# Altium project MB1225.PrjPCB (part 3 of 4)

## Sheet USB_OTG_HS.SchDoc: USB OTG HS PHY with micro A-B connector
size A4; Date: 29-OCT-2015; Author: A.B; CompanyName: STMicroelectronics; Organization: MCD/TOOLS/GNB; Address1: 12, Rue Jules HOROWITZ; Address2: 38019 Grenoble; Address3: FRANCE; DocumentNumber: MB1225; Revision: B-01; SheetNumber: 9; SheetTotal: 13; Project: STM32F769I-DISCO
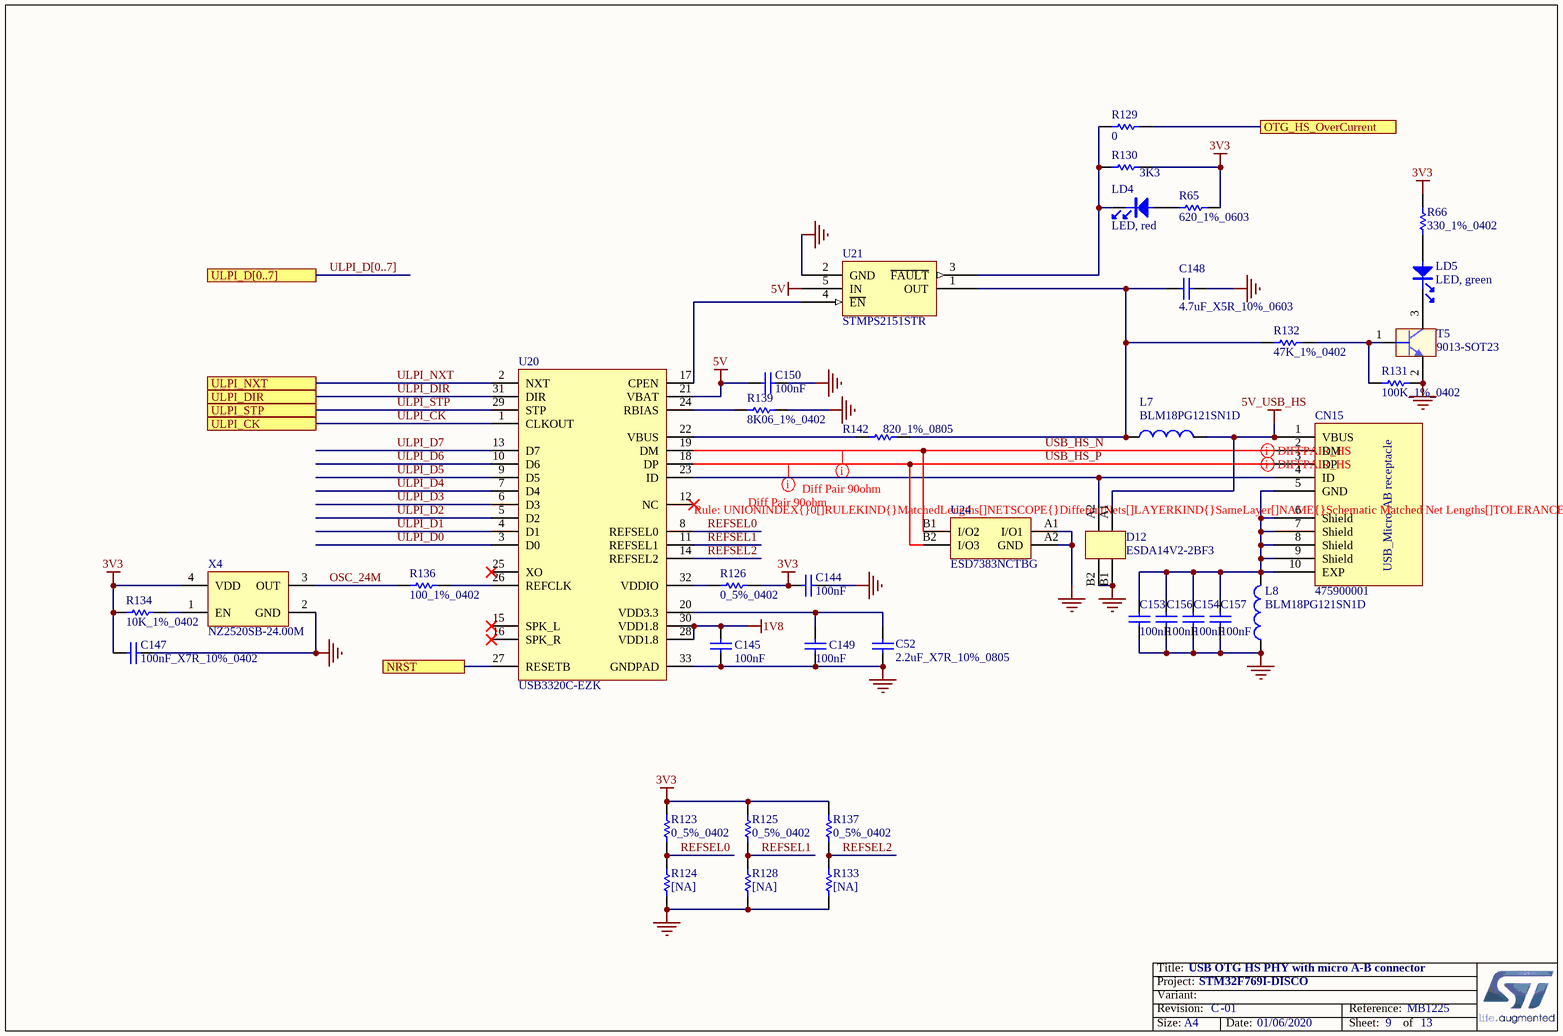
[diagram p8: USB_OTG_HS.SchDoc]

### Parts
C52  2.2uF_X7R_10%_0805  [TAN-A]
C144  100nF  [0402C]
C145  100nF  [0402C]
C147  100nF_X7R_10%_0402  [0402C]
C148  4.7uF_X5R_10%_0603  [0603C]
C149  100nF  [0402C]
C150  100nF  [0402C]
C153  100nF  [0402C]
C154  100nF  [0402C]
C156  100nF  [0402C]
C157  100nF  [0402C]
CN15  475900001  [MOLEX_47590001]
D12  ESDA14V2-2BF3  [BGA4_0R4_0R8X0R8]
L7  BLM18PG121SN1D  [0603L]
L8  BLM18PG121SN1D  [0603L]
LD4  LED, red  [0603D]
LD5  LED, green  [0603D]
R65  620_1%_0603  [0603R]
R66  330_1%_0402  [0402R]
R123  0_5%_0402  [0402R]
R124  [NA]  [0402R]
R125  0_5%_0402  [0402R]
R126  0_5%_0402  [0402R]
R128  [NA]  [0402R]
R129  0  [0402R]
R130  3K3  [0402R]
R131  100K_1%_0402  [0402R]
R132  47K_1%_0402  [0402R]
R133  [NA]  [0402R]
R134  10K_1%_0402  [0402R]
R136  100_1%_0402  [0402R]
R137  0_5%_0402  [0402R]
R139  8K06_1%_0402  [0402R]
R142  820_1%_0805  [0805R]
T5  9013-SOT23  [SOT-23]
U20  USB3320C-EZK  [QFN32_0R5_5X5]
U21  STMPS2151STR  [SOT23-5]
U24  ESD7383NCTBG  [ESD_WLCSP4_CASE-567CB_0P80X0P80_P040]
X4  NZ2520SB-24.00M  [OSC_4SM_2R5X2]

### Ports
NRST, OTG_HS_OverCurrent, ULPI_CK, ULPI_D[0..7], ULPI_DIR, ULPI_NXT, ULPI_STP

### Nets
1V8: C145.2 U20.28(VDD1.8) U20.30(VDD1.8)
3V3: C144.1 C147.1 R65.2 R66.2 R123.2 R125.2 R126.2 R130.1 R134.1 R137.2 X4.4(VDD)
5V: C150.1 U20.21(VBAT) U21.5(IN)
5V_USB_HS: CN15.1(VBUS) D12.A1 L7.2
GND: C52.1 C144.2 C145.1 C147.2 C148.2 C149.1 C150.2 C153.1 C154.1 C156.1 C157.1 D12.B1 D12.B2 L8.1 R124.1 R128.1 R131.2 R133.1 R139.2 T5.2(E) U20.33(GNDPAD) U21.2(GND) U24.A1(I/O1) U24.A2(GND) X4.2(GND)  [project net POE7]
NRST: U20.27(RESETB) ; port NRST
OSC_24M: R136.1 X4.3(OUT)
OTG_HS_OverCurrent: R129.2 ; port OTG_HS_OverCurrent
REFSEL0: R123.1 R124.2 U20.8(REFSEL0)
REFSEL1: R125.1 R128.2 U20.11(REFSEL1)
REFSEL2: R133.2 R137.1 U20.14(REFSEL2)
ULPI_CK: U20.1(CLKOUT) ; port ULPI_CK
ULPI_D0: U20.3(D0)
ULPI_D1: U20.4(D1)
ULPI_D2: U20.5(D2)
ULPI_D3: U20.6(D3)
ULPI_D4: U20.7(D4)
ULPI_D5: U20.9(D5)
ULPI_D6: U20.10(D6)
ULPI_D7: U20.13(D7)
ULPI_DIR: U20.31(DIR) ; port ULPI_DIR
ULPI_NXT: U20.2(NXT) ; port ULPI_NXT
ULPI_STP: U20.29(STP) ; port ULPI_STP
USB_HS_N: CN15.2(DM) U20.19(DM) U24.B1(I/O2)
USB_HS_P: CN15.3(DP) U20.18(DP) U24.B2(I/O3)
NetC52_2: C52.2 C149.2 U20.20(VDD3.3)
NetC148_1: C148.1 L7.1 R132.1 R142.2 U21.1(OUT)
NetC153_2: C153.2 C154.2 C156.2 C157.2 CN15.5(GND) CN15.6(Shield) CN15.7(Shield) CN15.8(Shield) CN15.9(Shield) CN15.10(EXP) L8.2
NetCN15_4: CN15.4(ID) D12.A2 U20.23(ID)
NetLD4_1: LD4.1 R65.1
NetLD4_2: LD4.2 R129.1 R130.2 U21.3(~{FAULT})
NetLD5_1: LD5.1 R66.1
NetLD5_2: LD5.2 T5.3(C)
NetR126_1: R126.1 U20.32(VDDIO)
NetR131_1: R131.1 R132.2 T5.1(B)
NetR134_2: R134.2 X4.1(EN)
NetR136_2: R136.2 U20.26(REFCLK)
NetR139_1: R139.1 U20.24(RBIAS)
NetR142_1: R142.1 U20.22(VBUS)
NetU20_17: U20.17(CPEN) U21.4(~{EN})

Not connected (* = marked no-connect by the designer): U20 12(NC)* 15(SPK_L)* 16(SPK_R)* 25(XO)*

### Buses and harness runs
bus ULPI_D[0..7] = port ULPI_D[0..7]

### Layout directives
differential pair: USB_HS_N, USB_HS_P
rule Matched Net Lengths [Tolerance = 150mil]: USB_HS_N, USB_HS_P

### Notes on the sheet
- Title:
- Project:
- Size:
- Revision:
- Variant:
- A4
- -
- Date:
- Reference:
- Sheet:
- of
- (in symbol 475900001) USB_Micro-AB receptacle

### Library data of the parts
C52 = Cap_2.2uF_X7R_10%_0805: Capacitor,2.2uF,16V, X7R,10%,0805,YAGEO; Manuf_Part_1: CC0805KKX7R7BB225; Revision: July-2002: Re-released for DXP Platform.; Value: 2.2uF; Order: CC0805KKX7R7BB225; Manuf_1: YAGEO; ECCN_US/EU: n/a
C144 C145 C147 C149 C150 C153 C154 C156 C157 = Cap_100nF_X7R_10%_0402: Capacitor,100nF,16V,X7R,10%,0402,YAGEO; Manuf_Part_1: CC0402KRX7R7BB104; Revision: July-2002: Re-released for DXP Platform.; Value: 100nF; Order: CC0402KRX7R7BB104; Manuf_1: YAGEO
  C147: ECCN_US/EU: n/a
C148 = Cap_4.7uF_X5R_10%_0603: Capacitor,4.7uF,16V, X5R,10%,0603,YAGEO; Manuf_Part_1: CC0603KRX5R7BB475; Order: CC0603KRX5R7BB105; Revision: July-2002: Re-released for DXP Platform.; Value: 4.7uF; Manuf_1: YAGEO; ECCN_US/EU: n/a
CN15 = 475900001: USB-MICRO-AB, 47590-0001, SMT, MOLEX; Manuf_Part_1: 47590-0001; Manuf_1: MOLEX; ECCN_US/EU: n/a
D12 = ESDA14V2-2BF3: Quad bidirectional Transil array for ESD protection; Manuf_1: STM; ECCN_US/EU: EAR99/NEC; Provided: ST; Ref St: 9179040; Distrib: ST; Manuf_Part_1: ESDA14V2-2BF3
L7 L8 = BEAD_120R_2A_0603: Bead,120R,2A,0603,BLM18PG121SN1D,MURATA; Manuf_Part_3: FCM1608KF-601T03; Manuf_2: TDK; Manuf_Part_2: MPZ1608S300A; Manuf_3: Tai-tech; Value: 100uH; Description_3: Bead,600R,350mA,0603,FCM1608KF-601T03,Tai-tech; Description_2: Bead,30R,5A,0603,MPZ1608S300A,TDK; Revision: July-2002: Re-released for DXP Platform.; ECCN_US/EU: n/a; Manuf_Part_1: BLM18PG121SN1D; Manuf_1: MURATA
LD4 = LED_red: LED, red, 0603; Manuf_1: everlight; Manuf_Part_1: 19-213-R6C-AP1Q2B/3T; ECCN_US/EU: EAR99/NEC; Order: 19-213-R6C-AP1Q2B/3T
LD5 = LED_green: LED, green, 0603; Manuf_1: everlight; Manuf_Part_1: 19-213SYGC/S530-E2/TR8; ECCN_US/EU: EAR99/NEC; Order: 19-213SYGC/S530-E2/TR8
R65 = Res_620_1%_0603: Resistor,620,0603,1%,VISHAY; Manuf_Part_1: CRCW0603620RFKEA; Manuf_1: VISHAY DRALORIC; Value: 620; Order: 2122341; ECCN_US/EU: n/a; Distrib: FARNELL
R66 = Res_330_1%_0402: Resistor,330,0402,1%,YAGEO; Manuf_Part_1: RC0402FR-07330RL; Value: 330; ECCN_US/EU: n/a; Manuf_1: YAGEO; Distrib: DIGIKEY; Order: RC0402FR-07330RL
R123 R125 R126 R137 = Res_0_5%_0402: Resistor,0,0402,5%,YAGEO; Manuf_Part_1: RC0402JR-070RL; Value: 0; Order: 2363467; ECCN_US/EU: n/a; Manuf_1: YAGEO; Distrib: FARNELL
R124 R128 R133 = Res_NA_0402: Resistor,[NA],0402; Fitted: NO; Value: [NA]; ECCN_US/EU: n/a
R129 = Res_0_5%_0402: Resistor,0,0402,5%,YAGEO; Manuf_Part_1: RC0402JR-070RL; Order: 2363467; Value: 0; ECCN_US/EU: n/a; Manuf_1: YAGEO; Distrib: FARNELL
R130 = Res_3K3_1%_0402: Resistor,3K3,0402,1%,YAGEO; Manuf_Part_1: RC0402FR-073K3L; Value: 3K3; Manuf_1: YAGEO; Order: *; ECCN_US/EU: n/a; Distrib: FARNELL
R131 = Res_100K_1%_0402: Resistor,100K,0402,1%,YAGEO; Manuf_Part_1: RC0402FR-07100KL; Manuf_Part_2: RT0402FRE07100KL; Value: 100K; Manuf_1: YAGEO; ECCN_US/EU: n/a; Manuf_2: YAGEO
R132 = Res_47K_1%_0402: Resistor,47K,0402,1%,YAGEO; Manuf_Part_1: RC0402FR-0747KL; Order: 9239430; Value: 47K; Manuf_1: YAGEO; ECCN_US/EU: n/a; Distrib: FARNELL
R134 = Res_10K_1%_0402: Resistor,10K,0402,1%,YAGEO; Manuf_Part_1: RC0402FR-0710KL; Value: 10K; Manuf_1: YAGEO; Order: RC0402FR-0710KL; ECCN_US/EU: n/a
R136 = Res_100_1%_0402: Resistor,100,0402,1%,YAGEO; Manuf_Part_1: RC0402FR-07100RL; Value: 100; Order: 9239111; Manuf_1: YAGEO; ECCN_US/EU: n/a; Distrib: FARNELL
R139 = Res_8K06_1%_0402: Resistor,8K06,0402,1%,YAGEO; Manuf_Part_1: RC0402FR-078K06L; Value: 8K06; Manuf_1: YAGEO; Order: RC0402FR-078K06L; ECCN_US/EU: n/a; Distrib: DIGIKEY
R142 = Res_820_1%_0805: Resistor,820,0805,1%,YAGEO; Manuf_Part_1: RC0805FR-07820RL; Value: 820; Manuf_1: YAGEO; Order: RC0805FR-07820RL; ECCN_US/EU: n/a
T5 = 9013-SOT23: NPN Bipolar Transistor; Manuf_1: NXP; Manuf_Part_1: BSR14; Order: 1081310; ECCN_US/EU: EAR99/NEC; Revision: July-2002: Re-released for DXP Platform.; Distrib: FARNELL
U20 = USB3320C-EZK: USB3320C,  Hi-Speed USB Host, Device or OTG PHY with ULPI Low Pin Interface; Manuf_1: MICROCHIP; Manuf_Part_1: USB3320C-EZK-TR; ECCN_US/EU: EAR99/NEC; Provided: Sub Co; Distrib: MICROCHIP; Order: USB3320C-EZK-TR
U21 = STMPS2151STR: Enhanced single channel power switches; Manuf_1: STM; Provided: ST; ECCN_US/EU: EAR99/NEC; Ref St: xxxxxx; Order: STMPS2151STR; Manuf_Part_1: STMPS2151STR; Distrib: ST
U24 = MCD-01979: Diode, 3-line low capacitance protection for high speed USB; Manufacturer: ON SEMICONDUCTOR; Provided_By: SUBCO; ECCN_EU: NEC; ECCN_US: EAR99; Internal_Part_Number: MCD-01979; Value: ESD7383NCTBG; Status: Checked; Part_Type: Diode; Manufacturer_Part_Number: ESD7383NCTBG; Alternate_Manufacturer: N/A; Alternate_Manufacturer_Part_Number: N/A; ComponentLink1Description: Datasheet; ComponentLink1URL: http://tunmcdsvn.tun.st.com/Component_Datasheet_Library/Trunk/Diodes/ON_Semi_ESD_ESD7383NCTBG; Order_Code_Digikey: ESD7383NCTBGOSCT-ND; Order_Code_Farnell: 3003821RL; Order_Code_RS: N/A
X4 = OSC_24M_NZ2520SB: Oscillator 24.00Mhz, -+50PPM, 3.3V, Temp -55 to +125°C; Manuf_Part_2: KC2520B24.0000C10E00; Manuf_1: NDK; Manuf_Part_1: NZ2520SB 24MHz END4869A; Manuf_2: AVX Corp/Kyocera Corp; ECCN_US/EU: EAR99/NEC; Ref St: 9157032; Provided: ST; Order: *

## Sheet STM32F7.SchDoc: STM32F769NIH6 Connexion
size A3; Date: 29-OCT-2015; Author: A.B; CompanyName: STMicroelectronics; Organization: MCD/TOOLS/GNB; Address1: 12, Rue Jules HOROWITZ; Address2: 38019 Grenoble; Address3: FRANCE; DocumentNumber: MB1225; Revision: B-01; SheetNumber: 4; SheetTotal: 13; Project: STM32F769I-DISCO
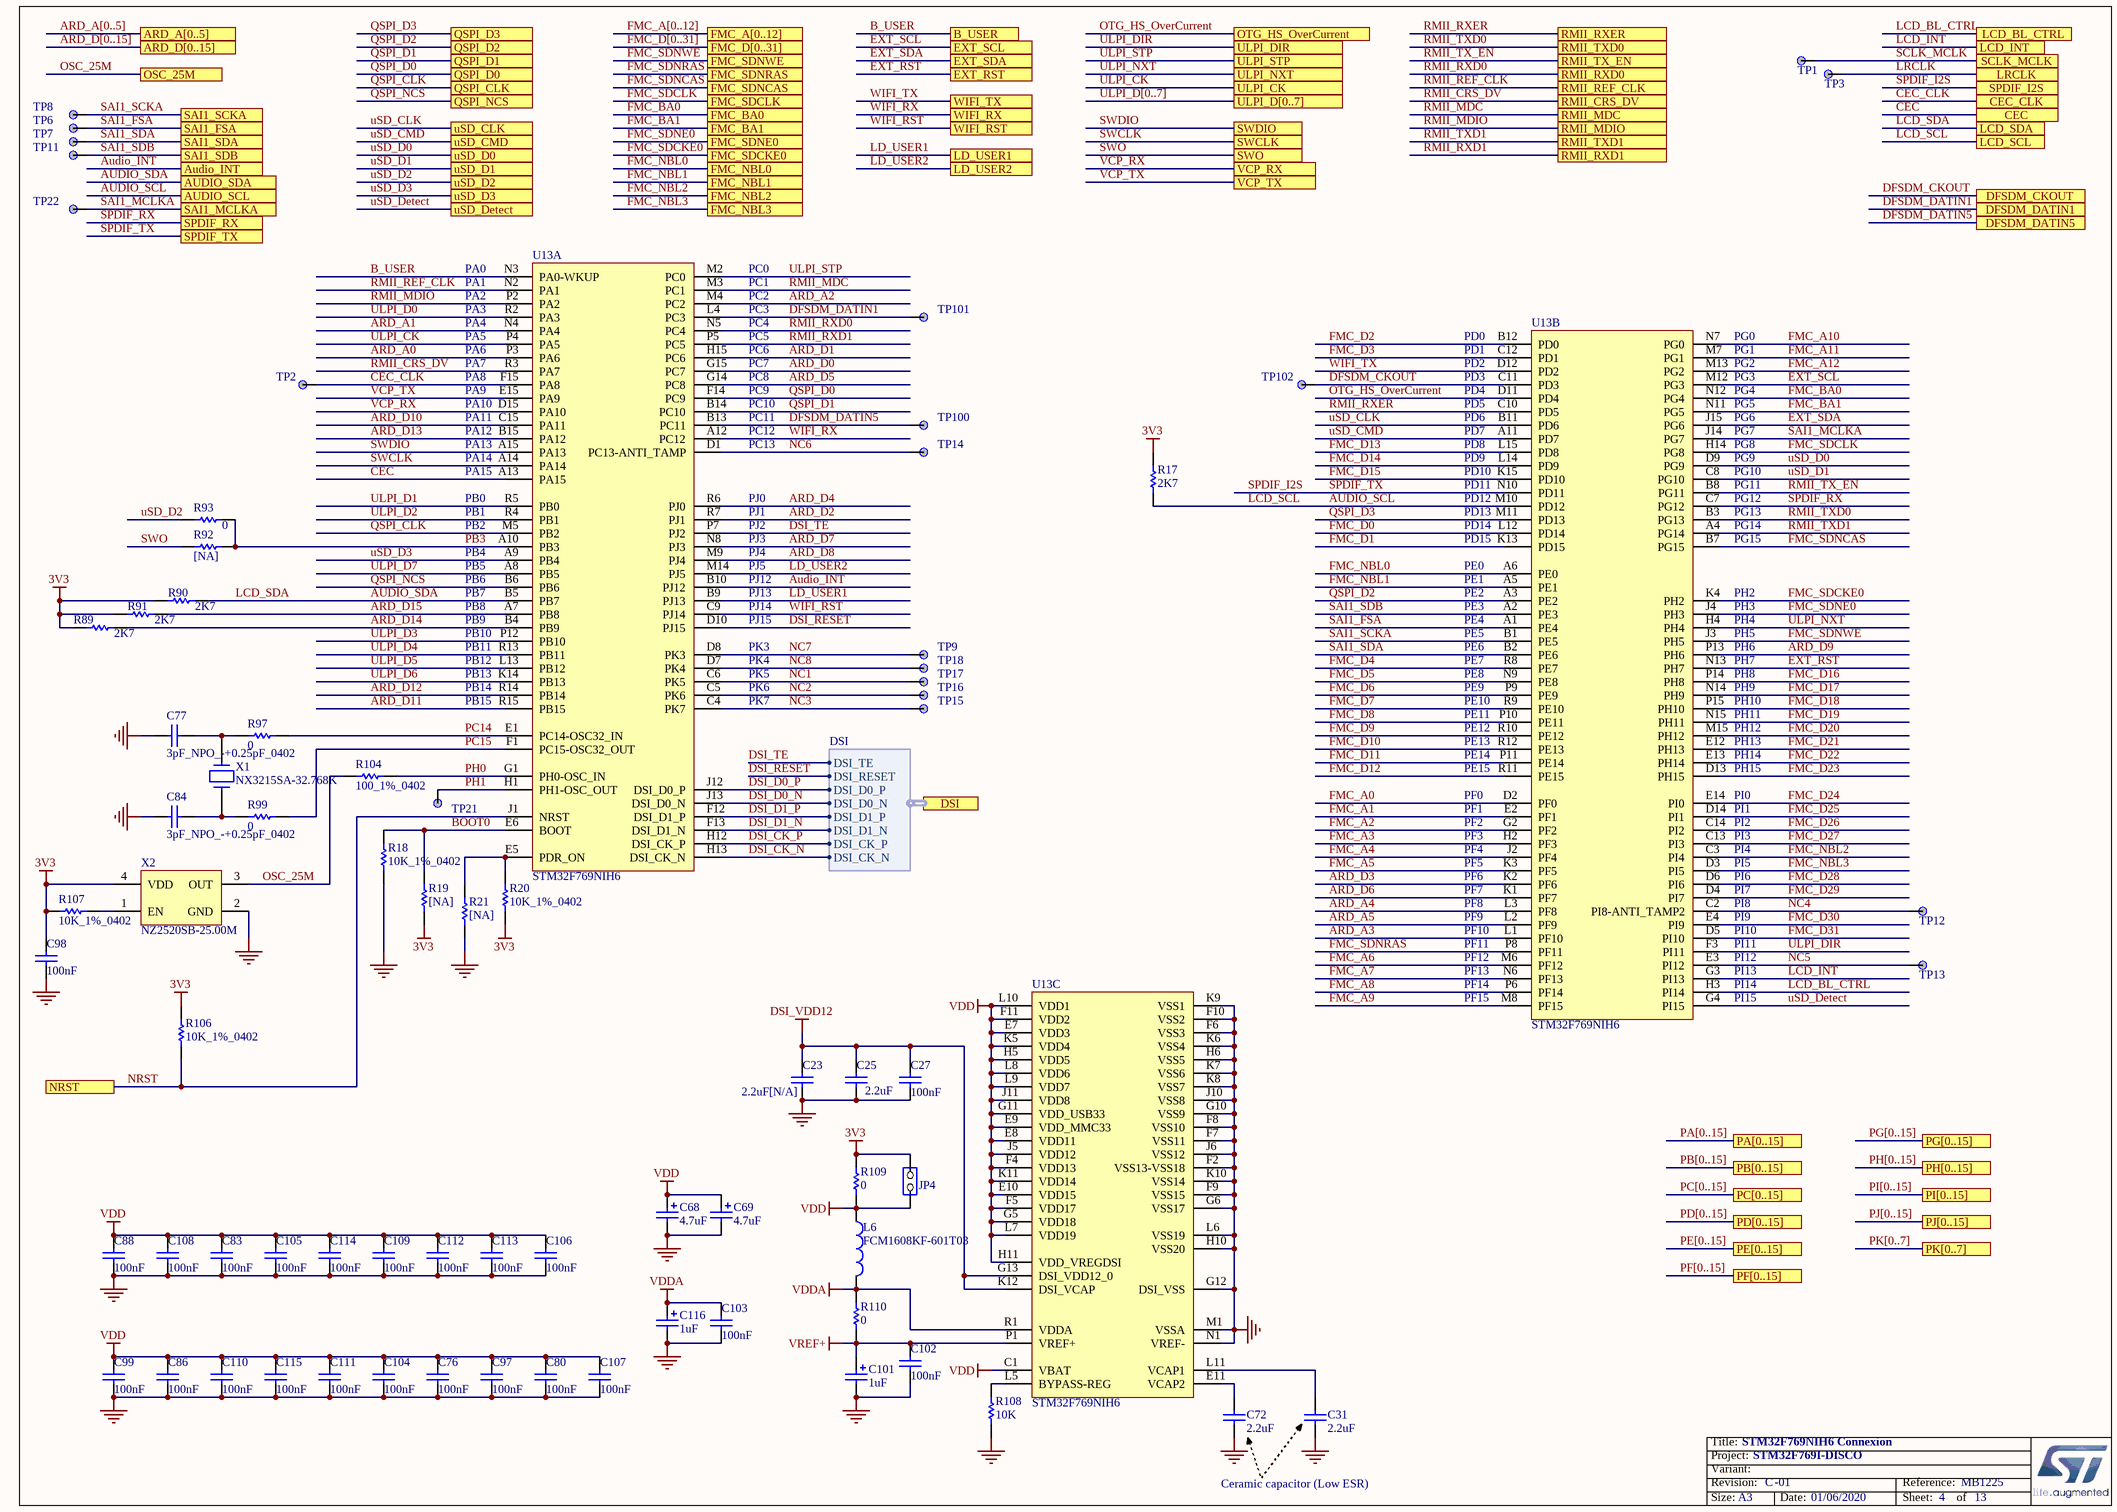
[diagram p9: STM32F7.SchDoc]

### Parts
C23  2.2uF[N/A]  [1206C]
C25  2.2uF  [0603C]
C27  100nF  [0402C]
C31  2.2uF  [1206C]
C68  4.7uF  [TAN-A]
C69  4.7uF  [TAN-A]
C72  2.2uF  [1206C]
C76  100nF  [0402C]
C77  3pF_NPO_-+0.25pF_0402  [0402C]
C80  100nF  [0402C]
C83  100nF  [0402C]
C84  3pF_NPO_-+0.25pF_0402  [0402C]
C86  100nF  [0402C]
C88  100nF  [0402C]
C97  100nF  [0402C]
C98  100nF  [0402C]
C99  100nF  [0402C]
C101  1uF  [TAN-A]
C102  100nF  [0402C]
C103  100nF  [0402C]
C104  100nF  [0402C]
C105  100nF  [0402C]
C106  100nF  [0402C]
C107  100nF  [0402C]
C108  100nF  [0402C]
C109  100nF  [0402C]
C110  100nF  [0402C]
C111  100nF  [0402C]
C112  100nF  [0402C]
C113  100nF  [0402C]
C114  100nF  [0402C]
C115  100nF  [0402C]
C116  1uF  [TAN-A]
JP4  JP2  [SIP2]  (value not drawn)
L6  FCM1608KF-601T03  [0603L]
R17  2K7  [0402R]
R18  10K_1%_0402  [0402R]
R19  [NA]  [0402R]
R20  10K_1%_0402  [0402R]
R21  [NA]  [0402R]
R89  2K7  [0402R]
R90  2K7  [0402R]
R91  2K7  [0402R]
R92  [NA]  [0402R]
R93  0  [0402R]
R97  0  [0402R]
R99  0  [0402R]
R104  100_1%_0402  [0402R]
R106  10K_1%_0402  [0402R]
R107  10K_1%_0402  [0402R]
R108  10K  [0402R]
R109  0  [0603R-GS]
R110  0  [0603R-GS]
TP1  TP  [TP_C40]  (value not drawn)
TP2  TP  [TP_C40]  (value not drawn)
TP3  TP  [TP_C40]  (value not drawn)
TP6  TP  [TP_C40]  (value not drawn)
TP7  TP  [TP_C40]  (value not drawn)
TP8  TP  [TP_C40]  (value not drawn)
TP9  TP  [TP_C40]  (value not drawn)
TP11  TP  [TP_C40]  (value not drawn)
TP12  TP  [TP_C40]  (value not drawn)
TP13  TP  [TP_C40]  (value not drawn)
TP14  TP  [TP_C40]  (value not drawn)
TP15  TP  [TP_C40]  (value not drawn)
TP16  TP  [TP_C40]  (value not drawn)
TP17  TP  [TP_C40]  (value not drawn)
TP18  TP  [TP_C40]  (value not drawn)
TP21  TP  [TP_C40]  (value not drawn)
TP22  TP  [TP_C40]  (value not drawn)
TP100  TP  [TP_C40]  (value not drawn)
TP101  TP  [TP_C40]  (value not drawn)
TP102  TP  [TP_C40]  (value not drawn)
U13  STM32F769NIH6  [BGA216_0R8_13X13]  (parts A,B,C of 3)
X1  NX3215SA-32.768K  [XTAL_2SM_3R2X1R5]
X2  NZ2520SB-25.00M  [OSC_4SM_2R5X2]

### Ports
ARD_A[0..5], ARD_D[0..15], Audio_INT, AUDIO_SCL, AUDIO_SDA, B_USER, CEC, CEC_CLK, DFSDM_CKOUT, DFSDM_DATIN1, DFSDM_DATIN5, DSI (harness DSI), EXT_RST, EXT_SCL, EXT_SDA, FMC_A[0..12], FMC_BA0, FMC_BA1, FMC_D[0..31], FMC_NBL0, FMC_NBL1, FMC_NBL2, FMC_NBL3, FMC_SDCKE0, FMC_SDCLK, FMC_SDNCAS, FMC_SDNE0, FMC_SDNRAS, FMC_SDNWE, LCD_BL_CTRL, LCD_INT, LCD_SCL, LCD_SDA, LD_USER1, LD_USER2, LRCLK, NRST, OSC_25M, OTG_HS_OverCurrent, PA[0..15], PB[0..15], PC[0..15], PD[0..15], PE[0..15], PF[0..15], PG[0..15], PH[0..15], PI[0..15], PJ[0..15], PK[0..7], QSPI_CLK, QSPI_D0, QSPI_D1, QSPI_D2, QSPI_D3, QSPI_NCS, RMII_CRS_DV, RMII_MDC, RMII_MDIO, RMII_REF_CLK, RMII_RXD0, RMII_RXD1, RMII_RXER, RMII_TX_EN, RMII_TXD0, RMII_TXD1, SAI1_FSA, SAI1_MCLKA, SAI1_SCKA, SAI1_SDA, SAI1_SDB, SCLK_MCLK, SPDIF_I2S, SPDIF_RX, SPDIF_TX, SWCLK, SWDIO, SWO, ULPI_CK, ULPI_D[0..7], ULPI_DIR, ULPI_NXT, ULPI_STP, uSD_CLK, uSD_CMD, uSD_D0, uSD_D1, uSD_D2, uSD_D3, uSD_Detect, VCP_RX, VCP_TX, WIFI_RST, WIFI_RX, WIFI_TX

### Harnesses
DSI: DSI_CK_P, DSI_CK_N, DSI_D0_P, DSI_D0_N, DSI_D1_P, DSI_D1_N, DSI_TE, DSI_RESET

### Nets
3V3: C98.2 JP4.2(NO) R17.2 R19.1 R20.1 R89.1 R90.1 R91.1 R106.2 R107.1 R109.2 X2.4(VDD)
DSI_VDD12: C23.2 C25.2 C27.2 U13.G13(DSI_VDD12_0) U13.K12(DSI_VCAP)
GND: C23.1 C25.1 C27.1 C31.1 C68.2 C69.2 C72.1 C76.1 C77.1 C80.1 C83.1 C84.1 C86.1 C88.1 C97.1 C98.1 C99.1 C101.2 C102.1 C103.1 C104.1 C105.1 C106.1 C107.1 C108.1 C109.1 C110.1 C111.1 C112.1 C113.1 C114.1 C115.1 C116.2 R18.1 R21.1 R108.1 U13.F2(VSS13-VSS18) U13.F6(VSS3) U13.F7(VSS11) U13.F8(VSS10) U13.F9(VSS15) U13.F10(VSS2) U13.G6(VSS17) U13.G10(VSS9) U13.G12(DSI_VSS) U13.H6(VSS5) U13.H10(VSS20) U13.J6(VSS12) U13.J10(VSS8) U13.K6(VSS4) U13.K7(VSS6) U13.K8(VSS7) U13.K9(VSS1) U13.K10(VSS14) U13.L6(VSS19) U13.M1(VSSA) U13.N1(VREF-) X2.2(GND)  [project net POE7]
VDD: C68.1 C69.1 C76.2 C80.2 C83.2 C86.2 C88.2 C97.2 C99.2 C104.2 C105.2 C106.2 C107.2 C108.2 C109.2 C110.2 C111.2 C112.2 C113.2 C114.2 C115.2 JP4.1(COMMON) L6.1 R109.1 U13.C1(VBAT) U13.E7(VDD3) U13.E8(VDD11) U13.E9(VDD_MMC33) U13.E10(VDD15) U13.F4(VDD13) U13.F5(VDD17) U13.F11(VDD2) U13.G5(VDD18) U13.G11(VDD_USB33) U13.H5(VDD5) U13.H11(VDD_VREGDSI) U13.J5(VDD12) U13.J11(VDD8) U13.K5(VDD4) U13.K11(VDD14) U13.L7(VDD19) U13.L8(VDD6) U13.L9(VDD7) U13.L10(VDD1)
VDDA: C103.2 C116.1 L6.2 R110.1 U13.R1(VDDA)
VREF+: C101.1 C102.2 R110.2 U13.P1(VREF+)
ARD_A0: U13.P3(PA6)
ARD_A1: U13.N4(PA4)
ARD_A2: U13.M4(PC2)
ARD_A3: U13.L1(PF10)
ARD_A4: U13.L3(PF8)
ARD_A5: U13.L2(PF9)
ARD_D0: U13.G15(PC7)
ARD_D1: U13.H15(PC6)
ARD_D2: U13.R7(PJ1)
ARD_D3: U13.K2(PF6)
ARD_D4: U13.R6(PJ0)
ARD_D5: U13.G14(PC8)
ARD_D6: U13.K1(PF7)
ARD_D7: U13.N8(PJ3)
ARD_D8: U13.M9(PJ4)
ARD_D9: U13.P13(PH6)
ARD_D10: U13.C15(PA11)
ARD_D11: U13.R15(PB15)
ARD_D12: U13.R14(PB14)
ARD_D13: U13.B15(PA12)
ARD_D14: R89.2 U13.B4(PB9)
ARD_D15: R91.2 U13.A7(PB8)
Audio_INT: U13.B10(PJ12) ; port Audio_INT
AUDIO_SCL: R17.1 U13.M10(PD12) ; port AUDIO_SCL, port LCD_SCL  [also labelled LCD_SCL]
AUDIO_SDA: R90.2 U13.B5(PB7) ; port AUDIO_SDA, port LCD_SDA  [also labelled LCD_SDA]
B_USER: U13.N3(PA0-WKUP) ; port B_USER
BOOT0: R18.2 R19.2 U13.E6(BOOT)
CEC: U13.A13(PA15) ; port CEC
CEC_CLK: TP2.1 U13.F15(PA8) ; port CEC_CLK
DFSDM_CKOUT: TP102.1 U13.C11(PD3) ; port DFSDM_CKOUT
DFSDM_DATIN1: TP101.1 U13.L4(PC3) ; port DFSDM_DATIN1
DFSDM_DATIN5: TP100.1 U13.B13(PC11) ; port DFSDM_DATIN5
DSI_CK_N: U13.H13(DSI_CK_N) ; port DSI.DSI_CK_N
DSI_CK_P: U13.H12(DSI_CK_P) ; port DSI.DSI_CK_P
DSI_D0_N: U13.J13(DSI_D0_N) ; port DSI.DSI_D0_N
DSI_D0_P: U13.J12(DSI_D0_P) ; port DSI.DSI_D0_P
DSI_D1_N: U13.F13(DSI_D1_N) ; port DSI.DSI_D1_N
DSI_D1_P: U13.F12(DSI_D1_P) ; port DSI.DSI_D1_P
DSI_RESET: U13.D10(PJ15) ; port DSI.DSI_RESET
DSI_TE: U13.P7(PJ2) ; port DSI.DSI_TE
EXT_RST: U13.N13(PH7) ; port EXT_RST
EXT_SCL: U13.M12(PG3) ; port EXT_SCL
EXT_SDA: U13.J15(PG6) ; port EXT_SDA
FMC_A0: U13.D2(PF0)
FMC_A1: U13.E2(PF1)
FMC_A2: U13.G2(PF2)
FMC_A3: U13.H2(PF3)
FMC_A4: U13.J2(PF4)
FMC_A5: U13.K3(PF5)
FMC_A6: U13.M6(PF12)
FMC_A7: U13.N6(PF13)
FMC_A8: U13.P6(PF14)
FMC_A9: U13.M8(PF15)
FMC_A10: U13.N7(PG0)
FMC_A11: U13.M7(PG1)
FMC_A12: U13.M13(PG2)
FMC_BA0: U13.N12(PG4) ; port FMC_BA0
FMC_BA1: U13.N11(PG5) ; port FMC_BA1
FMC_D0: U13.L12(PD14)
FMC_D1: U13.K13(PD15)
FMC_D2: U13.B12(PD0)
FMC_D3: U13.C12(PD1)
FMC_D4: U13.R8(PE7)
FMC_D5: U13.N9(PE8)
FMC_D6: U13.P9(PE9)
FMC_D7: U13.R9(PE10)
FMC_D8: U13.P10(PE11)
FMC_D9: U13.R10(PE12)
FMC_D10: U13.R12(PE13)
FMC_D11: U13.P11(PE14)
FMC_D12: U13.R11(PE15)
FMC_D13: U13.L15(PD8)
FMC_D14: U13.L14(PD9)
FMC_D15: U13.K15(PD10)
FMC_D16: U13.P14(PH8)
FMC_D17: U13.N14(PH9)
FMC_D18: U13.P15(PH10)
FMC_D19: U13.N15(PH11)
FMC_D20: U13.M15(PH12)
FMC_D21: U13.E12(PH13)
FMC_D22: U13.E13(PH14)
FMC_D23: U13.D13(PH15)
FMC_D24: U13.E14(PI0)
FMC_D25: U13.D14(PI1)
FMC_D26: U13.C14(PI2)
FMC_D27: U13.C13(PI3)
FMC_D28: U13.D6(PI6)
FMC_D29: U13.D4(PI7)
FMC_D30: U13.E4(PI9)
FMC_D31: U13.D5(PI10)
FMC_NBL0: U13.A6(PE0) ; port FMC_NBL0
FMC_NBL1: U13.A5(PE1) ; port FMC_NBL1
FMC_NBL2: U13.C3(PI4) ; port FMC_NBL2
FMC_NBL3: U13.D3(PI5) ; port FMC_NBL3
FMC_SDCKE0: U13.K4(PH2) ; port FMC_SDCKE0
FMC_SDCLK: U13.H14(PG8) ; port FMC_SDCLK
FMC_SDNCAS: U13.B7(PG15) ; port FMC_SDNCAS
FMC_SDNE0: U13.J4(PH3) ; port FMC_SDNE0
FMC_SDNRAS: U13.P8(PF11) ; port FMC_SDNRAS
FMC_SDNWE: U13.J3(PH5) ; port FMC_SDNWE
LCD_BL_CTRL: U13.H3(PI14) ; port LCD_BL_CTRL
LCD_INT: U13.G3(PI13) ; port LCD_INT
LD_USER1: U13.B9(PJ13) ; port LD_USER1
LD_USER2: U13.M14(PJ5) ; port LD_USER2
LRCLK: TP3.1 ; port LRCLK
NC1: TP17.1 U13.C6(PK5)
NC2: TP16.1 U13.C5(PK6)
NC3: TP15.1 U13.C4(PK7)
NC4: TP12.1 U13.C2(PI8-ANTI_TAMP2)
NC5: TP13.1 U13.E3(PI12)
NC6: TP14.1 U13.D1(PC13-ANTI_TAMP)
NC7: TP9.1 U13.D8(PK3)
NC8: TP18.1 U13.D7(PK4)
NRST: R106.1 U13.J1(NRST) ; port NRST
OSC_25M: R104.1 X2.3(OUT) ; port OSC_25M
OTG_HS_OverCurrent: U13.D11(PD4) ; port OTG_HS_OverCurrent
PB3: R92.2 R93.2 U13.A10(PB3)
PC14: R97.2 U13.E1(PC14-OSC32_IN)
PC15: R99.2 U13.F1(PC15-OSC32_OUT)
PH0: R104.2 U13.G1(PH0-OSC_IN)
PH1: TP21.1 U13.H1(PH1-OSC_OUT)
QSPI_CLK: U13.M5(PB2) ; port QSPI_CLK
QSPI_D0: U13.F14(PC9) ; port QSPI_D0
QSPI_D1: U13.B14(PC10) ; port QSPI_D1
QSPI_D2: U13.A3(PE2) ; port QSPI_D2
QSPI_D3: U13.M11(PD13) ; port QSPI_D3
QSPI_NCS: U13.B6(PB6) ; port QSPI_NCS
RMII_CRS_DV: U13.R3(PA7) ; port RMII_CRS_DV
RMII_MDC: U13.M3(PC1) ; port RMII_MDC
RMII_MDIO: U13.P2(PA2) ; port RMII_MDIO
RMII_REF_CLK: U13.N2(PA1) ; port RMII_REF_CLK
RMII_RXD0: U13.N5(PC4) ; port RMII_RXD0
RMII_RXD1: U13.P5(PC5) ; port RMII_RXD1
RMII_RXER: U13.C10(PD5) ; port RMII_RXER
RMII_TX_EN: U13.B8(PG11) ; port RMII_TX_EN
RMII_TXD0: U13.B3(PG13) ; port RMII_TXD0
RMII_TXD1: U13.A4(PG14) ; port RMII_TXD1
SAI1_FSA: TP6.1 U13.A1(PE4) ; port SAI1_FSA
SAI1_MCLKA: TP22.1 U13.J14(PG7) ; port SAI1_MCLKA
SAI1_SCKA: TP8.1 U13.B1(PE5) ; port SAI1_SCKA
SAI1_SDA: TP7.1 U13.B2(PE6) ; port SAI1_SDA
SAI1_SDB: TP11.1 U13.A2(PE3) ; port SAI1_SDB
SCLK_MCLK: TP1.1 ; port SCLK_MCLK
SPDIF_I2S: U13.N10(PD11) ; port SPDIF_TX, port SPDIF_I2S  [also labelled SPDIF_TX]
SPDIF_RX: U13.C7(PG12) ; port SPDIF_RX
SWCLK: U13.A14(PA14) ; port SWCLK
SWDIO: U13.A15(PA13) ; port SWDIO
SWO: R92.1 ; port SWO
ULPI_CK: U13.P4(PA5) ; port ULPI_CK
ULPI_D0: U13.R2(PA3)
ULPI_D1: U13.R5(PB0)
ULPI_D2: U13.R4(PB1)
ULPI_D3: U13.P12(PB10)
ULPI_D4: U13.R13(PB11)
ULPI_D5: U13.L13(PB12)
ULPI_D6: U13.K14(PB13)
ULPI_D7: U13.A8(PB5)
ULPI_DIR: U13.F3(PI11) ; port ULPI_DIR
ULPI_NXT: U13.H4(PH4) ; port ULPI_NXT
ULPI_STP: U13.M2(PC0) ; port ULPI_STP
uSD_CLK: U13.B11(PD6) ; port uSD_CLK
uSD_CMD: U13.A11(PD7) ; port uSD_CMD
uSD_D0: U13.D9(PG9) ; port uSD_D0
uSD_D1: U13.C8(PG10) ; port uSD_D1
uSD_D2: R93.1 ; port uSD_D2
uSD_D3: U13.A9(PB4) ; port uSD_D3
uSD_Detect: U13.G4(PI15) ; port uSD_Detect
VCP_RX: U13.D15(PA10) ; port VCP_RX
VCP_TX: U13.E15(PA9) ; port VCP_TX
WIFI_RST: U13.C9(PJ14) ; port WIFI_RST
WIFI_RX: U13.A12(PC12) ; port WIFI_RX
WIFI_TX: U13.D12(PD2) ; port WIFI_TX
NetC31_2: C31.2 U13.L11(VCAP1)
NetC72_2: C72.2 U13.E11(VCAP2)
NetC77_2: C77.2 R97.1 X1.1
NetC84_2: C84.2 R99.1 X1.2
NetR20_2: R20.2 R21.2 U13.E5(PDR_ON)
NetR107_2: R107.2 X2.1(EN)
NetR108_2: R108.2 U13.L5(BYPASS-REG)

### Buses and harness runs
bus ARD_A[0..5] = port ARD_A[0..5]
bus ARD_D[0..15] = port ARD_D[0..15]
bus FMC_A[0..12] = port FMC_A[0..12]
bus FMC_D[0..31] = port FMC_D[0..31]
bus PA[0..15] = port PA[0..15]
bus PB[0..15] = port PB[0..15]
bus PC[0..15] = port PC[0..15]
bus PD[0..15] = port PD[0..15]
bus PE[0..15] = port PE[0..15]
bus PF[0..15] = port PF[0..15]
bus PG[0..15] = port PG[0..15]
bus PH[0..15] = port PH[0..15]
bus PI[0..15] = port PI[0..15]
bus PJ[0..15] = port PJ[0..15]
bus PK[0..7] = port PK[0..7]
bus ULPI_D[0..7] = port ULPI_D[0..7]

### Notes on the sheet
- (near U13) PA3
- (near U13) PA2
- (near U13) PA1
- (near U13) PA0
- PC0
- PC1
- PC2
- PC3
- (near U13) PA6
- (near U13) PA5
- (near U13) PA4
- (near U13) PA7
- (near U13) PA8
- PC4
- PC5
- PC6
- PC7
- PC8
- (near U13) PD0
- (near U13) PD1
- (near U13) PD2
- (near U13) PD3
- (near U13) PG0
- (near U13) PG1
- (near U13) PG2
- (near U13) PG3
- (near U13) PA9
- (near U13) PA10
- (near U13) PA11
- (near U13) PA12
- (near U13) PA13
- PC9
- PC10
- PC11
- PC12
- PC13
- (near U13) PD4
- (near U13) PD5
- (near U13) PD6
- (near U13) PD7
- (near U13) PD8
- (near U13) PG4
- (near U13) PG5
- (near U13) PG6
- (near U13) PG7
- (near U13) PG8
- (near U13) PA14
- (near U13) PA15
- (near U13) PB1
- (near U13) PB0
- PJ0
- PJ1
- (near U13) PD9
- (near U13) PD10
- (near U13) PD11
- (near U13) PD12
- (near U13) PD13
- (near U13) PG9
- (near U13) PG10
- (near U13) PG11
- (near U13) PG12
- (near U13) PG13
- (near U13) PB6
- (near U13) PB5
- (near U13) PB4
- (near U13) PB2
- PJ2
- PJ3
- PJ4
- PJ5
- PJ12
- (near U13) PD14
- (near U13) PD15
- (near U13) PE0
- (near U13) PE1
- (near U13) PG14
- (near U13) PG15
- (near U13) PB7
- (near U13) PB8
- (near U13) PB9
- (near U13) PB10
- (near U13) PB11
- PJ13
- PJ14
- PJ15
- PK3
- (near U13) PE2
- (near U13) PE3
- (near U13) PE4
- (near U13) PE5
- (near U13) PE6
- (near U13) PH2
- (near U13) PH3
- (near U13) PH4
- (near U13) PH5
- (near U13) PH6
- (near U13) PB12
- (near U13) PB13
- (near U13) PB14
- (near U13) PB15
- PK4
- PK5
- PK6
- PK7
- (near U13) PE7
- (near U13) PE8
- (near U13) PE9
- (near U13) PE10
- (near U13) PE11
- (near U13) PH7
- (near U13) PH8
- (near U13) PH9
- (near U13) PH10
- (near U13) PH11
- (near U13) PE12
- (near U13) PE13
- (near U13) PE14
- (near U13) PE15
- (near U13) PH12
- (near U13) PH13
- (near U13) PH14
- (near U13) PH15
- (near U13) PF0
- (near U13) PF1
- (near U13) PF2
- (near U13) PF3
- (near U13) PF4
- (near U13) PI0
- (near U13) PI1
- (near U13) PI2
- (near U13) PI3
- (near U13) PI4
- (near U13) PF5
- (near U13) PF6
- (near U13) PF7
- (near U13) PF8
- (near U13) PF9
- (near U13) PI5
- (near U13) PI6
- (near U13) PI7
- (near U13) PI8
- (near U13) PI9
- (near U13) PF10
- (near U13) PF11
- (near U13) PF12
- (near U13) PF13
- (near U13) PF14
- (near U13) PI10
- (near U13) PI11
- (near U13) PI12
- (near U13) PI13
- (near U13) PI14
- (near U13) PF15
- (near U13) PI15
- Ceramic capacitor (Low ESR)
- Title:
- Project:
- Size:
- Revision:
- Variant:
- A3
- -
- Date:
- Reference:
- Sheet:
- of

### Library data of the parts
C23 = Cap_2.2uF_X7R_10%_1206: Capacitor,2.2uF,16V, X7R,10%,1206,YAGEO; Manuf_Part_1: CC1206KKX7R7BB225; Manuf_Part_2: C1206C225K4RAC; Manuf_2: KEMET; Fitted: NO; Revision: July-2002: Re-released for DXP Platform.; Value: 2.2uF; Order: CC1206KKX7R7BB225; Manuf_1: YAGEO; ECCN_US/EU: n/a
C25 = Cap_2.2uF_X5R_10%_0603: Capacitor,2.2uF,10V, X5R,10%,0603,YAGEO; Manuf_Part_1: CC0603KRX5R6BB225; Manuf_Part_2: C0603C225K8PACTU; Manuf_2: KEMET; Revision: July-2002: Re-released for DXP Platform.; Value: 2.2uF; Order: *; Manuf_1: YAGEO; ECCN_US/EU: n/a
C27 C76 C80 C83 C86 C88 C97-C99 C102-C115 = Cap_100nF_X7R_10%_0402: as C144 on sheet USB_OTG_HS; Revision: July-2002: Re-released for DXP Platform.; Value: 100nF; Order: CC0402KRX7R7BB104; Manuf_1: YAGEO
  C27: ECCN_US/EU: n/a
C31 C72 = Cap_2.2uF_X7R_10%_1206: Capacitor,2.2uF,16V, X7R,10%,1206,YAGEO; Manuf_Part_1: CC1206KKX7R7BB225; Manuf_Part_2: C1206C225K4RAC; Manuf_2: KEMET; Revision: July-2002: Re-released for DXP Platform.; Value: 2.2uF; Order: CC1206KKX7R7BB225; Manuf_1: YAGEO; ECCN_US/EU: n/a
C68 C69 = Cap_4.7uF_POL_10%_TANA: Polarized Capacitor,4.7uF,16V,10%,typeA,AVX; Manuf_Part_1: TAJA475K016R; Revision: July-2002: Re-released for DXP Platform.; Value: 4.7uF; Manuf_1: AVX; Order: TAJA475K016R; ECCN_US/EU: n/a
C77 C84 = Cap_4.3pF_NPO_-+0.25pF_0402: Capacitor, 3pF, 16V, NPO, -+0.25pF, 0402, KEMET; Manuf_1: AVX; Manuf_Part_1: C0402C439C4GACTU; Order: C0402C439C4GACTU-ND; Revision: July-2002: Re-released for DXP Platform.; Value: 3pF; ECCN_US/EU: n/a; Distrib: DIGIKEY
C101 C116 = Cap_1uF_POL_10%_TANA: Polarized Capacitor,1uF,16V,10%,typeA,AVX; Manuf_Part_1: TAJA105K016R; Revision: July-2002: Re-released for DXP Platform.; Value: 1uF; Manuf_1: AVX; Distrib: *; Order: TAJA105K016R; ECCN_US/EU: n/a
JP4 = JP2: Fitted: NO; ECCN_US/EU: n/a
L6 = BEAD_600R_350MA_0603: Bead,600R,350mA,0603,FCM1608KF-601T03,Tai-tech; Manuf_2: TDK; Manuf_Part_2: MPZ1608S300A; Manuf_Part_3: BLM18PG121SN1D; Manuf_3: MURATA; Value: 100uH; Description_2: Bead,30R,5A,0603,MPZ1608S300A,TDK; Description_3: Bead,120R,2A,0603,BLM18PG121SN1D,MURATA; Revision: July-2002: Re-released for DXP Platform.; Manuf_Part_1: FCM1608KF-601T03; Manuf_1: Tai-tech; ECCN_US/EU: n/a
R17 R89-R91 = Res_2K7_1%_0402: Resistor,2K7,0402,1%,YAGEO; Manuf_Part_1: RC0402FR-072K7L; Value: 2K7; Manuf_1: YAGEO; Order: RC0402FR-072K7L; ECCN_US/EU: n/a; Distrib: FARNELL
R18 R20 R106-R108 = Res_10K_1%_0402: as R134 on sheet USB_OTG_HS; Value: 10K; Manuf_1: YAGEO; Order: RC0402FR-0710KL; ECCN_US/EU: n/a
R19 R21 R92 = Res_NA_0402: Resistor,[NA],0402; Fitted: NO; Value: [NA]; ECCN_US/EU: n/a
R93 R97 R99 = Res_0_5%_0402: as R129 on sheet USB_OTG_HS; Value: 0; ECCN_US/EU: n/a; Manuf_1: YAGEO; Distrib: FARNELL
R104 = Res_100_1%_0402: as R136 on sheet USB_OTG_HS; Manuf_1: YAGEO; ECCN_US/EU: n/a; Distrib: FARNELL
R109 R110 = Res_0_5%_0603: Resistor,0,0603,5%,YAGEO; Manuf_Part_1: RC0603JR-070RL; Order: 2363481; Value: 0; ECCN_US/EU: n/a; Manuf_1: YAGEO; Distrib: FARNELL
TP1-TP3 TP6-TP9 TP11-TP18 TP21 TP22 TP100-TP102 = TP: Test Point; ECCN_US/EU: n/a
U13 = STM32F769NIH6U: STM32F769NIH6 (STM32F7 Big Birdie) TBGA216; Manuf_1: STM; ECCN_US/EU: 3A991A2/NEC; Ref St: xxxxxxxx; Provided: ST; Distrib: ST; Manuf_Part_1: STM32F769NIH6U; Order: STM32F769NIH6U
X1 = XTAL_32K_NX3215SA: Crystal 32.768kHz, 6pF, -+20PPM, R=50K, SMD; Manuf_1: NDK; Manuf_Part_1: NX3215SA 32.768KHz EXS00A-MU00525; ECCN_US/EU: EAR99/NEC; Ref St: 9157034; NDK Ref: X3101802; Provided: ST; Distrib: *; Order: NX3215SA 32.768KHz EXS00A-MU00525
X2 = OSC_25M_NZ2520SB: Oscillator 25.00Mhz, -+50PPM, 3.3V, Temp -55 to +125°C; Manuf_Part_1: NZ2520SB 25MHz END4869B; Manuf_1: NDK; Manuf_Part_2: KC2520B25.0000C10E00; Manuf_2: AVX Corp/Kyocera Corp; ECCN_US/EU: EAR99/NEC; Ref St: 9157031; Provided: ST; Order: *

## Sheet Ethernet.SchDoc: Ethernet PHY with RJ45 connector
size A4; Date: 29-OCT-2015; Author: A.B; CompanyName: STMicroelectronics; Organization: MCD/TOOLS/GNB; Address1: 12, Rue Jules HOROWITZ; Address2: 38019 Grenoble; Address3: FRANCE; DocumentNumber: MB1225; Revision: B-01; SheetNumber: 10; SheetTotal: 13; Project: STM32F769I-DISCO
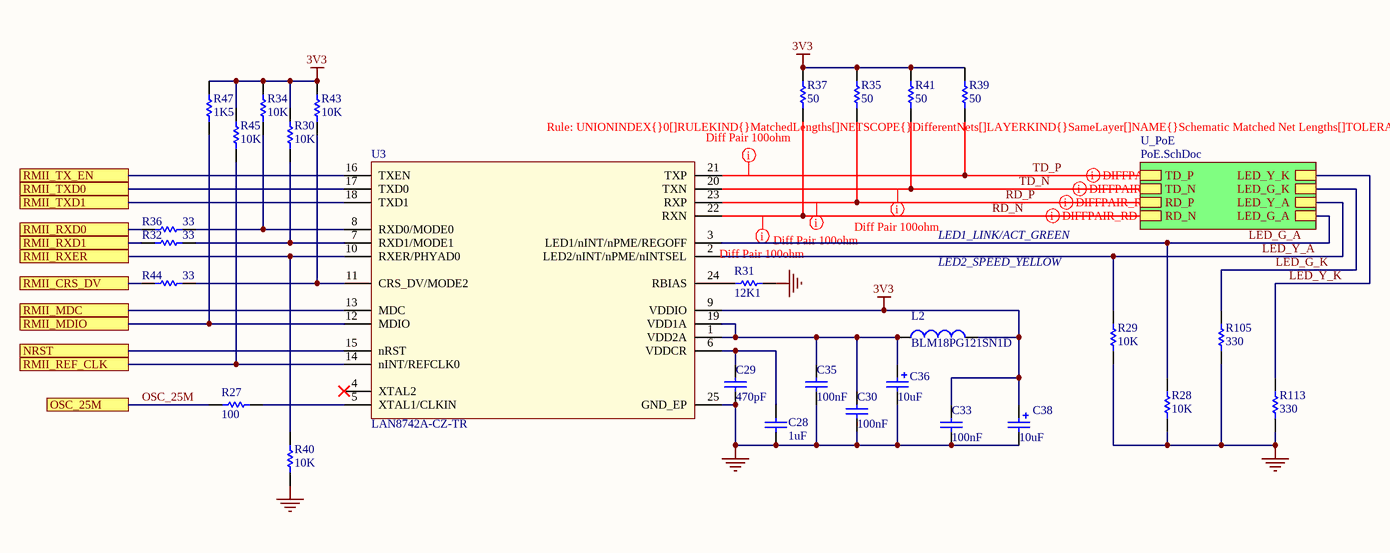
[diagram p10: Ethernet.SchDoc]

### Parts
C28  1uF  [0603C]
C29  470pF  [0402C]
C30  100nF  [0402C]
C33  100nF  [0402C]
C35  100nF  [0402C]
C36  10uF  [TAN-A]
C38  10uF  [TAN-A]
L2  BLM18PG121SN1D  [0603L]
R27  100  [0402R]
R28  10K  [0402R]
R29  10K  [0402R]
R30  10K  [0402R]
R31  12K1  [0603R]
R32  33  [0402R]
R34  10K  [0402R]
R35  50  [0402R]
R36  33  [0402R]
R37  50  [0402R]
R39  50  [0402R]
R40  10K  [0402R]
R41  50  [0402R]
R43  10K  [0402R]
R44  33  [0402R]
R45  10K  [0402R]
R47  1K5  [0402R]
R105  330  [0402R]
R113  330  [0402R]
U3  LAN8742A-CZ-TR  [QFN24_0R5_4X4]

### Sub-sheets
U_PoE = PoE.SchDoc: LED_G_A, LED_G_K, LED_Y_A, LED_Y_K, RD_P, TD_N, TD_P, RD_N

### Ports
NRST, OSC_25M, RMII_CRS_DV, RMII_MDC, RMII_MDIO, RMII_REF_CLK, RMII_RXD0, RMII_RXD1, RMII_RXER, RMII_TX_EN, RMII_TXD0, RMII_TXD1

### Nets
3V3: C33.2 C38.1 L2.2 R30.2 R34.2 R35.1 R37.1 R39.1 R41.1 R43.2 R45.2 R47.2 U3.9(VDDIO)
GND: C28.1 C29.1 C30.1 C33.1 C35.1 C36.2 C38.2 R28.1 R29.1 R31.2 R40.1 R105.1 R113.1 U3.25(GND_EP)  [project net POE7]
LED_G_A: R28.2 U3.3(LED1/nINT/nPME/REGOFF) ; sheet U_PoE/LED_G_A
LED_G_K: R105.2 ; sheet U_PoE/LED_G_K
LED_Y_A: R29.2 U3.2(LED2/nINT/nPME/nINTSEL) ; sheet U_PoE/LED_Y_A
LED_Y_K: R113.2 ; sheet U_PoE/LED_Y_K
NRST: U3.15(nRST) ; port NRST
OSC_25M: R27.1 ; port OSC_25M
RD_N: R37.2 U3.22(RXN) ; sheet U_PoE/RD_N
RD_P: R35.2 U3.23(RXP) ; sheet U_PoE/RD_P
RMII_CRS_DV: R44.2 ; port RMII_CRS_DV
RMII_MDC: U3.13(MDC) ; port RMII_MDC
RMII_MDIO: R47.1 U3.12(MDIO) ; port RMII_MDIO
RMII_REF_CLK: R45.1 U3.14(nINT/REFCLK0) ; port RMII_REF_CLK
RMII_RXD0: R36.2 ; port RMII_RXD0
RMII_RXD1: R32.2 ; port RMII_RXD1
RMII_RXER: R40.2 U3.10(RXER/PHYAD0) ; port RMII_RXER
RMII_TX_EN: U3.16(TXEN) ; port RMII_TX_EN
RMII_TXD0: U3.17(TXD0) ; port RMII_TXD0
RMII_TXD1: U3.18(TXD1) ; port RMII_TXD1
TD_N: R41.2 U3.20(TXN) ; sheet U_PoE/TD_N
TD_P: R39.2 U3.21(TXP) ; sheet U_PoE/TD_P
NetC28_2: C28.2 C29.2 U3.6(VDDCR)
NetC30_2: C30.2 C35.2 C36.1 L2.1 U3.1(VDD2A) U3.19(VDD1A)
NetR27_2: R27.2 U3.5(XTAL1/CLKIN)
NetR30_1: R30.1 R32.1 U3.7(RXD1/MODE1)
NetR31_1: R31.1 U3.24(RBIAS)
NetR34_1: R34.1 R36.1 U3.8(RXD0/MODE0)
NetR43_1: R43.1 R44.1 U3.11(CRS_DV/MODE2)

Not connected (* = marked no-connect by the designer): U3 4(XTAL2)*

### Layout directives
differential pair: RD_N, RD_P, TD_N, TD_P
rule Matched Net Lengths [Tolerance = 100mil]: RD_N, RD_P, TD_N, TD_P

### Notes on the sheet
- LED2_SPEED_YELLOW
- LED1_LINK/ACT_GREEN
- Title:
- Project:
- Size:
- Revision:
- Variant:
- A4
- -
- Date:
- Reference:
- Sheet:
- of

### Library data of the parts
C28 = Cap_1uF_X5R_10%_0603: Capacitor,1uF,16V,X5R,10%,0603,YAGEO; Manuf_Part_1: CC0603KRX5R7BB105; Revision: July-2002: Re-released for DXP Platform.; Value: 1uF; Order: CC0603KRX5R7BB105; Manuf_1: YAGEO; ECCN_US/EU: n/a
C29 = Cap_470pF_X7R_10%_0402: Capacitor,470pF,16V,X7R,10%,0402,YAGEO; Manuf_Part_1: 0402YC471KAT4A; Revision: July-2002: Re-released for DXP Platform.; Value: 470pF; Order: 0402YC471KAT4A; Manuf_1: YAGEO; ECCN_US/EU: n/a
C30 C33 C35 = Cap_100nF_X7R_10%_0402: as C144 on sheet USB_OTG_HS; Revision: July-2002: Re-released for DXP Platform.; Value: 100nF; Order: CC0402KRX7R7BB104; Manuf_1: YAGEO
C36 C38 = Cap_10uF_POL_10%_TANA: Polarized Capacitor,10uF,10V,10%,typeA,VISHAY; Manuf_Part_1: 293D106X9010A2TE3; Revision: July-2002: Re-released for DXP Platform.; Value: 10uF; Manuf_1: VISHAY; Order: *; ECCN_US/EU: n/a
L2 = BEAD_120R_2A_0603: as L7 on sheet USB_OTG_HS; Revision: July-2002: Re-released for DXP Platform.; ECCN_US/EU: n/a; Manuf_Part_1: BLM18PG121SN1D; Manuf_1: MURATA
R27 = Res_100_1%_0402: Resistor,100,0402,1%,YAGEO; Manuf_Part_1: RC0402FR-07100RL; Order: 9239111; Value: 100; Manuf_1: YAGEO; ECCN_US/EU: n/a; Distrib: FARNELL
R28-R30 R34 R40 R43 R45 = Res_10K_1%_0402: as R134 on sheet USB_OTG_HS; Value: 10K; Manuf_1: YAGEO; Order: RC0402FR-0710KL; ECCN_US/EU: n/a
R31 = Res_12K1_1%_0603: Resistor,12K1,0603,1%,VISHAY; Manuf_Part_1: MCT 0603-50 1% P5 12K1; Order: 2325243; Value: 12K1; ECCN_US/EU: n/a; Manuf_1: VISHAY; Distrib: FARNELL
R32 R36 R44 = Res_33_1%_0402: Resistor,33,0402,1%,YAGEO; Manuf_Part_1: RC0402FR-0733RL; Value: 33; Manuf_1: YAGEO; Order: *; ECCN_US/EU: n/a; Distrib: FARNELL
R35 R37 R39 R41 = Res_50_1%_0402: Resistor,50,0402,1%,YAGEO; Manuf_Part_1: RC0402FR-0750RL; Value: 50; Manuf_1: YAGEO; Order: *; ECCN_US/EU: n/a; Distrib: FARNELL
R47 = Res_1K5_1%_0402: Resistor,1K5,0402,1%,YAGEO; Manuf_Part_1: RC0402FR-071K5L; Value: 1K5; Manuf_1: YAGEO; Order: RC0402FR-071K5L; ECCN_US/EU: n/a; Distrib: FARNELL
R105 R113 = Res_330_1%_0402: Resistor,330,0402,1%,YAGEO; Manuf_Part_1: RC0402FR-07330RL; Value: 330; ECCN_US/EU: n/a; Manuf_1: YAGEO; Distrib: DIGIKEY; Order: RC0402FR-07330RL
U3 = LAN8742A-CZ-TR: LAN8742A-CZ-TR - Small Footprint RMII 10/100 Ethernet, Transceiver with HP Auto-MDIX and flexPWR Technology SQFN-24; Manuf_1: MICROCHIP; ECCN_US/EU: EAR99/NEC; Provided: Sub Co; Order: LAN8742A-CZ-TR; Manuf_Part_1: LAN8742A-CZ-TR; Distrib: MICROCHIP

## Sheet PoE.SchDoc: Power Over Ethernet 3W
size A4; Date: 29-OCT-2015; Author: A.B; CompanyName: STMicroelectronics; Organization: MCD/TOOLS/GNB; Address1: 12, Rue Jules HOROWITZ; Address2: 38019 Grenoble; Address3: FRANCE; DocumentNumber: MB1225; Revision: B-01; SheetNumber: 11; SheetTotal: 13; Project: STM32F769I-DISCO
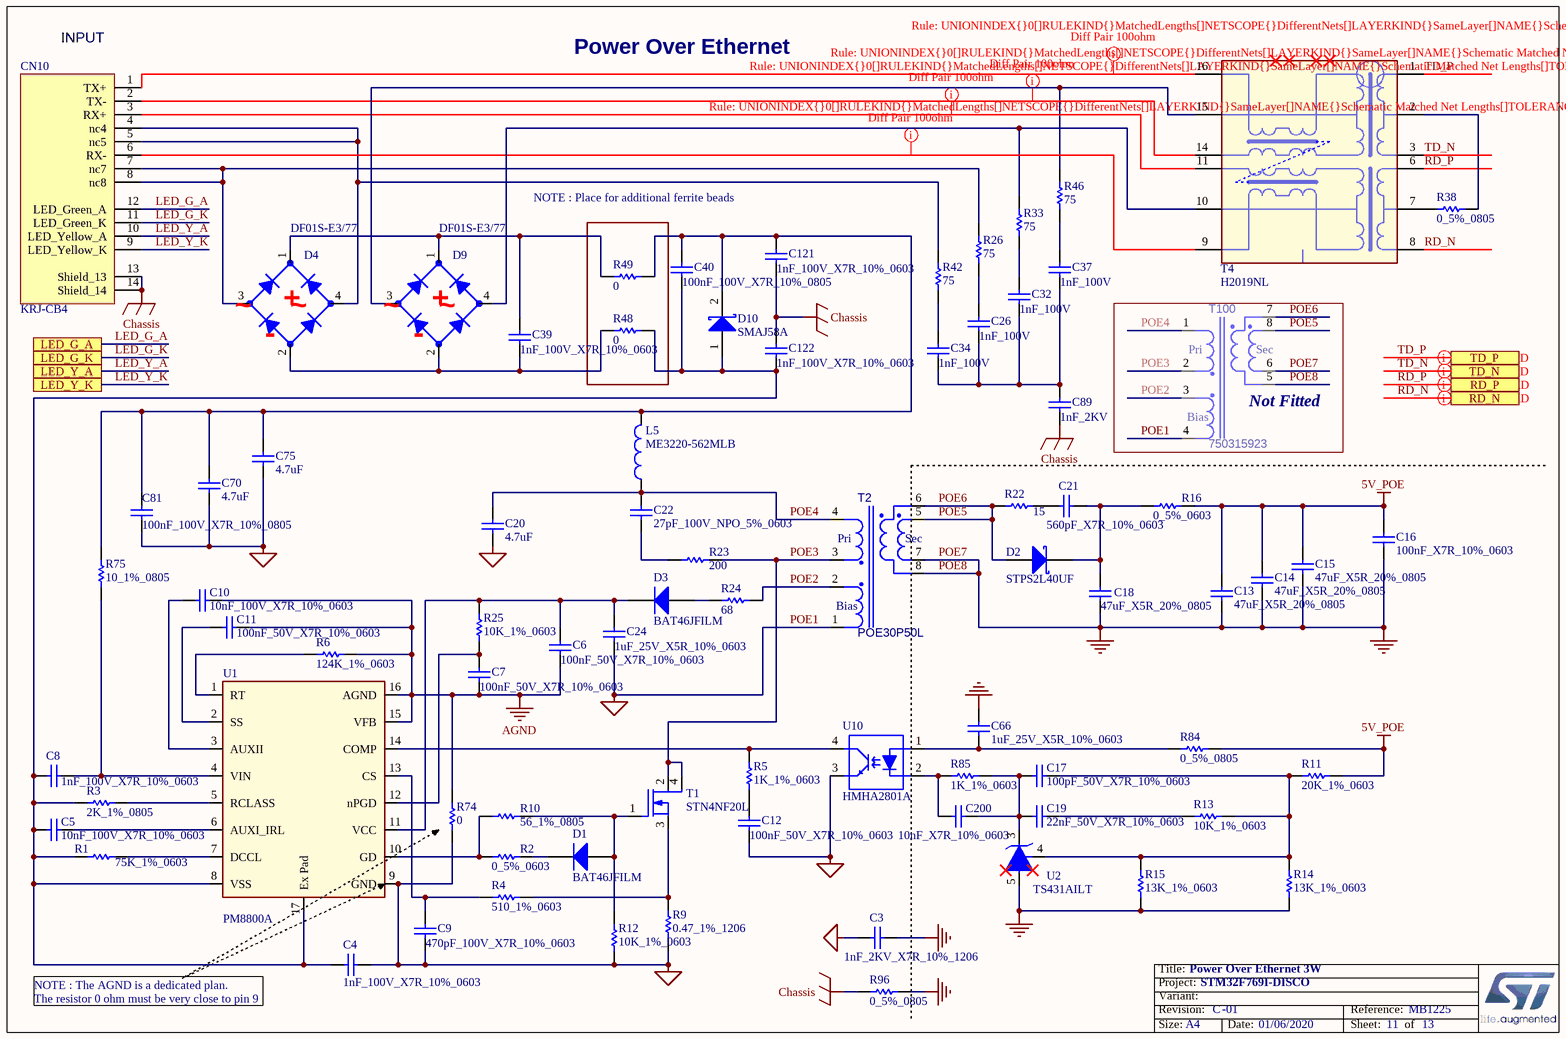
[diagram p11: PoE.SchDoc]

### Parts
C3  1nF_2KV_X7R_10%_1206  [1206C]
C4  1nF_100V_X7R_10%_0603  [0603C]
C5  10nF_100V_X7R_10%_0603  [0603C]
C6  100nF_50V_X7R_10%_0603  [0603C]
C7  100nF_50V_X7R_10%_0603  [0603C]
C8  1nF_100V_X7R_10%_0603  [0603C]
C9  470pF_100V_X7R_10%_0603  [0603C]
C10  10nF_100V_X7R_10%_0603  [0603C]
C11  100nF_50V_X7R_10%_0603  [0603C]
C12  100nF_50V_X7R_10%_0603  [0603C]
C13  47uF_X5R_20%_0805  [0805C]
C14  47uF_X5R_20%_0805  [0805C]
C15  47uF_X5R_20%_0805  [0805C]
C16  100nF_X7R_10%_0603  [0603C]
C17  100pF_50V_X7R_10%_0603  [0603C]
C18  47uF_X5R_20%_0805  [0805C]
C19  22nF_50V_X7R_10%_0603  [0603C]
C20  value 4.7uF  [C1210_H2P5]  (hidden comment: Capacitor)
C21  560pF_X7R_10%_0603  [0603C]
C22  27pF_100V_NPO_5%_0603  [0603C]
C24  1uF_25V_X5R_10%_0603  [0603C]
C26  1nF_100V  [0603C]
C32  1nF_100V  [0603C]
C34  1nF_100V  [0603C]
C37  1nF_100V  [0603C]
C39  1nF_100V_X7R_10%_0603  [0603C]
C40  100nF_100V_X7R_10%_0805  [0805C]
C66  1uF_25V_X5R_10%_0603  [0603C]
C70  value 4.7uF  [C1210_H2P5]  (hidden comment: Capacitor)
C75  value 4.7uF  [C1210_H2P5]  (hidden comment: Capacitor)
C81  100nF_100V_X7R_10%_0805  [0805C]
C89  1nF_2KV  [1206C]
C121  1nF_100V_X7R_10%_0603  [0603C]
C122  1nF_100V_X7R_10%_0603  [0603C]
C200  10nF_X7R_10%_0603  [0603C]
CN10  KRJ-CB4  [RJ45_LED_KRJ-CB4R2GYZNL_EM]
D1  BAT46JFILM  [SOD-323]
D2  STPS2L40UF  [SMB]
D3  BAT46JFILM  [SOD-323]
D4  value DF01S-E3/77  [BRF_VISHAY_DFS_DF01S]
D9  value DF01S-E3/77  [BRF_VISHAY_DFS_DF01S]
D10  SMAJ58A  [SMA]
L5  ME3220-562MLB  [LSM2_3R2X2R8_H2]
R1  75K_1%_0603  [0603R]
R2  0_5%_0603  [0603R-GS]
R3  2K_1%_0805  [0805R]
R4  510_1%_0603  [0603R]
R5  1K_1%_0603  [0603R]
R6  124K_1%_0603  [0603R]
R9  0.47_1%_1206  [1206R]
R10  56_1%_0805  [0805R]
R11  20K_1%_0603  [0603R]
R12  10K_1%_0603  [0603R]
R13  10K_1%_0603  [0603R]
R14  13K_1%_0603  [0603R]
R15  13K_1%_0603  [0603R]
R16  0_5%_0603  [0603R-GS]
R22  15  [0805R]
R23  200  [1206R]
R24  68  [0805R]
R25  10K_1%_0603  [0603R]
R26  75  [0805R]
R33  75  [0805R]
R38  0_5%_0805  [0805R]
R42  75  [0805R]
R46  75  [0805R]
R48  0  [0805R]
R49  0  [0805R]
R74  0  [0603R-GS]
R75  10_1%_0805  [0805R]
R84  0_5%_0805  [0805R]
R85  1K_1%_0603  [0603R]
R96  0_5%_0805  [0805R]
T1  STN4NF20L  [SOT-223]
T2  POE30P50L  [TF_10R9X13R2-12R2X14R4_CPT]
T4  H2019NL  [TF_16SM_12R7X9R65]
T100  750315923  [TF_8SM_12R04X12R85]
U1  PM8800A  [TSSOP16_0R65_5x6R4_TP]
U2  TS431AILT  [SOT23-5]
U10  HMHA2801A  [PC_4SM_1R27_2R5X6R8]

### Blocks framed on the sheet
Not Fitted: T100

### Ports
LED_G_A, LED_G_K, LED_Y_A, LED_Y_K, RD_N, RD_P, TD_N, TD_P

### Nets
5V_POE: C13.2 C14.2 C15.2 C16.2 R11.2 R16.2 R84.2
AGND: C6.1 C7.1 C10.2 C11.2 R6.2 R74.2 U1.15(VFB) U1.16(AGND)
Chassis: C89.1 C121.1 C122.2 CN10.13(Shield_13) CN10.14(Shield_14) R96.1
POE1: C3.1 C4.2 C9.1 C12.1 C20.1 C24.1 C70.1 C75.1 C81.1 R9.1 R12.1 R74.1 T2.1 T100.4 U1.9(GND) U10.3(Emitter)  [also labelled GND_POWER_IN]
POE7: C3.2 C13.1 C14.1 C15.1 C16.1 C18.1 C66.2 R14.1 R15.1 R96.2 T2.7 T2.8 T100.5 T100.6 U2.5(A)  [also labelled GND, POE8]
LED_G_A: CN10.12(LED_Green_A) ; port LED_G_A
LED_G_K: CN10.11(LED_Green_K) ; port LED_G_K
LED_Y_A: CN10.10(LED_Yellow_A) ; port LED_Y_A
LED_Y_K: CN10.9(LED_Yellow_K) ; port LED_Y_K
POE2: R24.2 T2.2 T100.3
POE3: R23.2 T1.2(D) T1.4(D) T2.3 T100.2
POE4: C20.2 C22.2 L5.1 T2.4 T100.1
POE5: D2.1(A) R22.1 T2.5 T2.6 T100.7 T100.8  [also labelled POE6]
RD_N: T4.8(rd-) ; port RD_N
RD_P: T4.6(rd+) ; port RD_P
TD_N: T4.3(td-) ; port TD_N
TD_P: T4.1(td+) ; port TD_P
NetC4_1: C4.1 C5.1 C8.1 C40.1 C122.1 D10.1(A) R1.1 R3.1 R48.2 U1.8(VSS) U1.17(Ex_Pad)
NetC5_2: C5.2 U1.6(AUXI_IRL)
NetC6_2: C6.2 C24.2 D3.2(K) R25.2 U1.11(VCC)
NetC7_2: C7.2 R25.1 U1.12(nPGD)
NetC8_2: C8.2 R75.1 U1.4(VIN)
NetC9_2: C9.2 R4.1 U1.13(CS)
NetC10_1: C10.1 U1.3(AUXII)
NetC11_1: C11.1 U1.2(SS)
NetC12_2: C12.2 R5.1
NetC17_1: C17.1 C19.1 C200.2 R85.2 U2.3(K)
NetC17_2: C17.2 R11.1 R13.2 R14.2 R15.2 U2.4(REF)
NetC18_2: C18.2 C21.2 D2.2(K) R16.1
NetC19_2: C19.2 R13.1
NetC21_1: C21.1 R22.2
NetC22_1: C22.1 R23.1
NetC26_1: C26.1 C32.1 C34.1 C37.1 C89.2
NetC26_2: C26.2 R26.1
NetC32_2: C32.2 R33.1
NetC34_2: C34.2 R42.1
NetC37_2: C37.2 R46.1
NetC39_1: C39.1 D4.2(DC_OUT_MINUS) D9.2(DC_OUT_MINUS) R48.1
NetC39_2: C39.2 D4.1(DC_OUT_PLUS) D9.1(DC_OUT_PLUS) R49.1
NetC40_2: C40.2 C70.2 C75.2 C81.2 C121.2 D10.2(K) L5.2 R49.2 R75.2
NetC66_1: C66.1 R84.1 U10.1(Anode)
NetC200_1: C200.1 R85.1 U10.2(B)
NetCN10_1: CN10.1(TX+) T4.16(tx1+)
NetCN10_2: CN10.2(TX-) T4.14(tx1-)
NetCN10_3: CN10.3(RX+) T4.11(rx1+)
NetCN10_4: CN10.4(nc4) CN10.5(nc5) D4.4(AC_IN_1) R42.2
NetCN10_6: CN10.6(RX-) T4.9(rx-)
NetCN10_7: CN10.7(nc7) CN10.8(nc8) D4.3(AC_IN_2) R26.2
NetD1_1: D1.1(A) R10.2 R12.2 T1.1(G)
NetD1_2: D1.2(K) R2.2
NetD3_1: D3.1(A) R24.1
NetD9_3: D9.3(AC_IN_2) R46.2 T4.15(txct)
NetD9_4: D9.4(AC_IN_1) R33.2 T4.10(rxct)
NetR1_2: R1.2 U1.7(DCCL)
NetR2_1: R2.1 R10.1 U1.10(GD)
NetR3_2: R3.2 U1.5(RCLASS)
NetR4_2: R4.2 R9.2 T1.3(S)
NetR5_2: R5.2 U1.14(COMP) U10.4(Collector)
NetR6_1: R6.1 U1.1(RT)
NetR38_1: R38.1 T4.7(rct)
NetR38_2: R38.2 T4.2(tct)

Not connected (* = marked no-connect by the designer): T4 4(nc_4)* 5(nc_5)* 12(nc_12)* 13(nc_13)*; U2 1(nc_1)* 2(nc_2)*

### Layout directives
differential pair: RD_N, RD_P, TD_N, TD_P
rule Matched Net Lengths [Tolerance = 100mil]: NetCN10_1, NetCN10_2, NetCN10_3, NetCN10_6

### Notes on the sheet
- (near CN10) INPUT
- Power Over Ethernet
- NOTE : Place for additional ferrite beads
- NOTE : The AGND is a dedicated plan.
  The resistor 0 ohm must be very close to pin 9
- Title:
- Project:
- Size:
- Revision:
- Variant:
- A4
- -
- Date:
- Reference:
- Sheet:
- of
- (in symbol MCD-02211) ~; +; -
- (in symbol POE30P_C) Pri; Sec; Bias
- (in symbol POE30P_W) Pri; Sec; Bias

### Library data of the parts
C3 C89 = Cap_1nF_2KV_X7R_10%_1206: Capacitor,1nF,2KV,X7R,10%,1206,YAGEO; Order: CC1206KKX7RDBB102; Revision: July-2002: Re-released for DXP Platform.; Value: 1nF; Manuf_1: YAGEO; Manuf_Part_1: CC1206KKX7RDBB102; ECCN_US/EU: n/a
C4 C8 C26 C32 C34 C37 C39 C121 C122 = Cap_1nF_100V_X7R_10%_0603: Capacitor,1nF,100V,X7R,10%,0603,YAGEO; Order: CC0603KRX7R0BB102; Revision: July-2002: Re-released for DXP Platform.; Value: 1nF; Manuf_1: YAGEO; Manuf_Part_1: CC0603KRX7R0BB102; ECCN_US/EU: n/a
C5 C10 = Cap_10nF_100V_X7R_10%_0603: Capacitor,10nF,100V,X7R,10%,0603,YAGEO; Manuf_Part_1: CC0603KRX7R0BB103; Revision: July-2002: Re-released for DXP Platform.; Value: 10nF; Order: CC0603KRX7R0BB103; Manuf_1: YAGEO; ECCN_US/EU: n/a
C6 C7 C11 C12 = Cap_100nF_50V_X7R_10%_0603: Capacitor,100nF,50V,X7R,10%,0603,YAGEO; Manuf_Part_1: CC0603KRX7R9BB104; Revision: July-2002: Re-released for DXP Platform.; Value: 100nF; Order: CC0603KRX7R9BB104; Manuf_1: YAGEO; ECCN_US/EU: n/a
C9 = Cap_470pF_100V_X7R_10%_0603: Capacitor,470pF,100V,X7R,10%,0603,AVX; Manuf_Part_1: 06031C471KAT2A; Revision: July-2002: Re-released for DXP Platform.; Value: 470pF; Order: 06031C471KAT2A; Manuf_1: AVX; ECCN_US/EU: n/a
C13-C15 C18 = Cap_47uF_X5R_20%_0805: Capacitor,47uF,10V,X5R,20%,0805,MURATA; Manuf_Part_1: GRM21BR61A476ME15K; Order: GRM21BR61A476ME15K-ND; Revision: July-2002: Re-released for DXP Platform.; Value: 47uF; Manuf_1: MURATA; ECCN_US/EU: n/a
C16 = Cap_100nF_X7R_10%_0603: Capacitor,100nF,16V,X7R,10%,0603,YAGEO; Manuf_Part_1: CC0603KRX7R9BB104; Revision: July-2002: Re-released for DXP Platform.; Value: 100nF; Order: CC0603KRX7R9BB104; Manuf_1: YAGEO; ECCN_US/EU: n/a
C17 = Cap_100pF_50V_X7R_10%_0603: Capacitor,100pF,50V,X7R,10%,0603,AVX; Manuf_Part_1: 06035C101JAT4A; Revision: July-2002: Re-released for DXP Platform.; Value: 100pF; Order: 06035C101JAT4A; Manuf_1: AVX; ECCN_US/EU: n/a
C19 = Cap_22nF_50V_X7R_10%_0603: Capacitor,22nF,50V,X7R,10%,0603,YAGEO; Manuf_Part_1: CC0603KRX7R9BB223; Revision: July-2002: Re-released for DXP Platform.; Value: 22nF; Order: CC0603KRX7R9BB223; Manuf_1: YAGEO; ECCN_US/EU: n/a
C20 C70 C75 = MCD-02212: Capacitor, MLCC, 4.7uF, 100V, X7S, +/-10%, 1210 , T=2.5mm; Part_Preference: Recommended; Manufacturer: TDK; Manufacturer_Part_Number: CGA6M3X7S2A475K200AB; Order_Code_RS: 111-0119; Internal_Part_Number: MCD-02212; Status: Checked; Part_Type: Capacitor; Alternate_Manufacturer: N/A; Alternate_Manufacturer_Part_Number: N/A; Package: 1210; ComponentLink1URL: http://tunmcdsvn.tun.st.com/Component_Documentation_Library/Trunk/Capacitor/TDK_CGA_Series; Order_Code_Digikey: 445-7005-1-ND; Order_Code_Farnell: 2211140RL
C21 = Cap_560pF_X7R_10%_0603: Capacitor,560pF,16V,X7R,10%,0603,AVX; Manuf_Part_1: 0603YC561KAT2A; Revision: July-2002: Re-released for DXP Platform.; Value: 560pF; Order: 0603YC561KAT2A; Manuf_1: AVX; ECCN_US/EU: n/a
C22 = Cap_27pF_100V_NPO_5%_0603: Capacitor,27pF,100V,NPO,5%,0603,YAGEO; Manuf_Part_1: CC0603JRNPO0BN270; Manuf_2: AVX; Manuf_Part_2: 06031A270JAT2A; Fitted: NO; Revision: July-2002: Re-released for DXP Platform.; Value: 27pF; Manuf_1: YAGEO; ECCN_US/EU: n/a
C24 C66 = Cap_1uF_25V_X5R_10%_0603: Capacitor,1uF,25V,X5R,10%,0603,YAGEO; Manuf_Part_1: CC0603KRX5R8BB105; Revision: July-2002: Re-released for DXP Platform.; Value: 1uF; Order: CC0603KRX5R8BB105; Manuf_1: YAGEO; ECCN_US/EU: n/a
C40 C81 = Cap_100nF_100V_X7R_10%_0805: Capacitor,100nF,100V,X7R,10%,0805,TDK; Order: C2012X7R2A104K125AA; Revision: July-2002: Re-released for DXP Platform.; Value: 100nF; Manuf_1: TDK; Manuf_Part_1: C2012X7R2A104K125AA; ECCN_US/EU: n/a
C200 = Cap_10nF_X7R_10%_0603: Capacitor,10nF,50V,X7R,10%,0603,YAGEO; Manuf_Part_1: CC0603KRX7R9BB103; Revision: July-2002: Re-released for DXP Platform.; Value: 10nF; Order: CC0603KRX7R9BB103; Manuf_1: YAGEO; ECCN_US/EU: n/a
CN10 = KRJ-CB4: 100 Base-TX (Fast Ethernet)  RJ45 single port (1x1) with LEDS Integrated Connector; Manuf_1: DGKYD; Manuf_Part_1: KRJ-CB4.2GYZNL; Distrib: Sub Co; Ref St: *; ECCN_US/EU: n/a
D1 D3 = BAT46JFILM: Schottky Single diode(150mA, 100V); Manuf_1: STM; Provided: ST; ECCN_US/EU: EAR99/NEC; Ref St: 9151125; Revision: July-2002: Re-released for DXP Platform.; Order: BAT46JFILM; Manuf_Part_1: BAT46JFILM; Distrib: ST
D2 = STPS2L40UF: Low drop power Schottky rectifier(2A, 40V, 0.34V); Manuf_1: STM; Order: STPS2L40AF; Provided: ST; ECCN_US/EU: EAR99/NEC; Code - JEDEC: ******; Note: SMB footprint will accept STPS2L40U/UF/AF; Ref St: 9151009; Manuf_Part_1: STPS2L40UF; Distrib: ST; Manuf_Part_2: STPS2L40U; Manuf_Part_3: STPS2L40AF
D4 D9 = MCD-02211: Surface Mount Bridge Rectifier 1A 100V; Part_Preference: Recommended; Part_Type: IC; Manufacturer: VISHAY; Internal_Part_Number: MCD-02211; Status: Checked; Manufacturer_Part_Number: DF01S-E3/77; Alternate_Manufacturer: N/A; Alternate_Manufacturer_Part_Number: N/A; Package: DFS; ComponentLink1Description: Part_Information; ComponentLink1URL: http://tunmcdsvn.tun.st.com/Component_Datasheet_Library/Trunk/IC/Vishay_Rectifiers_DF01S/Vishay_Rectifiers_DF01S.pdf
D10 = SMAJ58A: Transil 400W, VRM=58V; Manuf_1: STM; Manuf_Part_1: SMAJ58A-TR; ECCN_US/EU: EAR99/NEC; Provided: ST; Ref St: 9151124; Order: SMAJ58A-TR; Distrib: ST
L5 = ME3220-562ML: Power Inductor, 5.6uH, 0.2R, ME3220-562ML, CoilCraft; Manuf_2: Cyntec; Manuf_Part_2: SDET32251E-5R6MS-11; Revision: July-2002: Re-released for DXP Platform.; Value: 5.6uH; Manuf_Part_1: ME3220-562ML; Manuf_1: CoilCraft; Description_2: Power Inductor, 5.6uH, 0.2R, ME3220-562ML, CoilCraft; ECCN_US/EU: n/a
R1 = Res_75K_1%_0603: Resistor,75K,0603,1%,YAGEO; Manuf_Part_1: RC0603FR-0775KL; Value: 75K; ECCN_US/EU: n/a; Manuf_1: YAGEO; Distrib: Sub Co; Order: RC0603FR-0775KL
R2 R16 = Res_0_5%_0603: Resistor,0,0603,5%,YAGEO; Manuf_Part_1: RC0603JR-070RL; Value: 0; Order: 2363481; ECCN_US/EU: n/a; Manuf_1: YAGEO; Distrib: FARNELL
R3 = Res_2K_1%_0805: Resistor,2K,0805,1%,YAGEO; Manuf_Part_1: RC0805FR-072KL; Manuf_Part_2: RT0805FRE072KL; Value: 2K; Manuf_1: YAGEO; ECCN_US/EU: n/a
R4 = Res_510_1%_0603: Resistor,510,0603,1%,YAGEO; Manuf_Part_1: RC0603FR-07510RL; Value: 510; Manuf_1: YAGEO; Order: RC0603FR-07510RL; ECCN_US/EU: n/a; Distrib: Sub Co
R5 R85 = Res_1K_1%_0603: Resistor,1K,0603,1%,YAGEO; Manuf_Part_1: RC0603FR-071KL; Value: 1K; Manuf_1: YAGEO; Order: RC0603FR-071KL; ECCN_US/EU: n/a
R6 = Res_124K_1%_0603: Resistor,124K,0603,1%,YAGEO; Manuf_Part_1: RC0603FR-07124KL; Value: 124K; ECCN_US/EU: n/a; Manuf_1: YAGEO; Distrib: Sub Co; Order: RC0603FR-07124KL
R9 = Res_0.47_1%_1206: Resistor,0.47,1206,1%,YAGEO; Manuf_Part_1: RL1206FR-070R47L; Manuf_Part_2: LTR18EZPFLR470; Manuf_2: Rohm Semiconductor; Value: 0.47; Manuf_1: YAGEO; ECCN_US/EU: n/a
R10 = Res_56_1%_0805: Resistor,56,0805,1%,YAGEO; Manuf_Part_1: RC0805FR-0756RL; Value: 56; Order: 311-56.0CRTR-ND; Manuf_1: YAGEO; ECCN_US/EU: n/a; Distrib: DIGIKEY
R11 = Res_20K_1%_0603: Resistor,20K,0603,1%,YAGEO; Manuf_Part_1: RC0603FR-0720KL; Value: 20K; Manuf_1: YAGEO; Order: RC0603FR-0720KL; ECCN_US/EU: n/a
R12 R13 R25 = Res_10K_1%_0603: Resistor,10K,0603,1%,YAGEO; Manuf_Part_1: RC0603FR-0710KL; Value: 10K; Manuf_1: YAGEO; Order: RC0603FR-0710KL; ECCN_US/EU: n/a
R14 R15 = Res_13K_1%_0603: Resistor,13K,0603,1%,YAGEO; Manuf_Part_1: RC0603FR-0713KL; Value: 13K; Manuf_1: YAGEO; Order: RC0603FR-0713KL; ECCN_US/EU: n/a; Distrib: Sub Co
R22 = Res_15_1%_0805: Resistor,15,0805,1%,YAGEO; Manuf_Part_1: RC0805FR-0715RL; Value: 15; Manuf_1: YAGEO; Order: RC0805FR-0715RL; ECCN_US/EU: n/a
R23 = Res_200_1%_1206: Resistor,200,1206,1%,Rohm; Manuf_Part_1: LTR18EZPF2000; Manuf_1: Rohm Semiconductor; Fitted: NO; Value: 200; Order: LTR18EZPF2000; ECCN_US/EU: n/a
R24 = Res_68_1%_0805: Resistor,68,0805,1%,YAGEO; Manuf_Part_1: RC0805FR-0768RL; Value: 68; Manuf_1: YAGEO; Order: RC0805FR-0768RL; ECCN_US/EU: n/a
R26 R33 R42 R46 = Res_75_1%_0805: Resistor,75,0805,1%,YAGEO; Manuf_Part_1: RC0805FR-0775RL; Order: 311-75.0CRTR-ND; Value: 75; Manuf_1: YAGEO; ECCN_US/EU: n/a; Distrib: DIGIKEY
R38 = Res_0_5%_0805: Resistor,0,0805,5%,YAGEO; Manuf_Part_1: RC0805JR-070RL; Value: 0; Order: 2363489; Fitted: NO; ECCN_US/EU: n/a; Manuf_1: YAGEO
R48 R49 = Res_0_5%_0805: Resistor,0,0805,5%,YAGEO; Manuf_Part_1: RC0805JR-070RL; Order: 2363489; Value: 0; ECCN_US/EU: n/a; Manuf_1: YAGEO
R74 = Res_0_5%_0603: as R109 on sheet STM32F7; Value: 0; ECCN_US/EU: n/a; Manuf_1: YAGEO; Distrib: FARNELL
R75 = Res_10_1%_0805: Resistor,10,0805,1%,Stackpole,1/4W; Manuf_Part_1: RNCP0805FTD10R0; Manuf_1: Stackpole Electronics Inc; Value: 10; Order: RNCP0805FTD10R0; ECCN_US/EU: n/a
R84 R96 = Res_0_5%_0805: Resistor,0,0805,5%,YAGEO; Manuf_Part_1: RC0805JR-070RL; Value: 0; Order: 2363489; ECCN_US/EU: n/a; Manuf_1: YAGEO
T1 = STN4NF20L: N-channel 200 V, 1.1ohm, 1 A, low gate charge STripFET II, Power MOSFET; Manuf_2: Fairchild; Manuf_Part_2: FDN86246; Manuf_1: ST; ECCN_US/EU: EAR99/NEC; Ref St: 9153018; Manuf_Part_1: STN4NF20L; Provided: ST
T2 = POE30P_C: Flyback Transformers for 3 Watt, PoE applications, CoilCraft Cyntec; Manuf_Part_1: POEP30P50L; Manuf_Part_2: 86H-15181; Provided: Sub Co; Note: for Cyntec, Secondary 6, 7 removed; Manuf_1: CoilCraft; ECCN_US/EU: n/a; Manuf_2: Cyntec
T4 = H2019: 10/100BASE-TX VoIP Magnetics Modules, Data Transformer; Manuf_Part_2: TLA-6T127LF, with different pinout; Manuf_1: PULSE; Manuf_2: TDK; Manuf_Part_3: KMS-1102NL; Manuf_3: DGKYD; Double foot print: TLA-6T127LF, pin 10, 12, 13, 15 differents; ECCN_US/EU: EAR99/NEC; Manuf_Part_1: H2019NL
T100 = POE30P_W: Flyback Transformers for 3 Watt, PoE applications, Wurth; Provided: Sub Co; Note: Compatible with CoilCraft but swap pins 1 and 4, pins 2 and 3, pins 5 and 8, pins 6 and 7; Fitted: NO; Manuf_1: Wurth; Manuf_Part_1: 750315923; ECCN_US/EU: n/a
U1 = PM8800A: Integrated IEEE 802.3af compliant PoE-PD interface, and PWM controller with support of external source; Manuf_Part_1: PM8800ATR; Manuf_1: ST; Provided: STM; ECCN_US/EU: EAR99/NEC; Ref St: 9177966; Distrib: ST
U2 = TS431AILT: Low voltage adjustable shunt reference; Manuf_1: ST; ECCN_US/EU: EAER99/NEC; Ref St: 9177032; Manuf_Part_1: TS431AILT; Provided: ST
U10 = HMHA2801A: OPTOISOLATOR 3.7KV TRANSISTOR 4SMD; Manuf_1: FAIRCHILD; Order: HMHA2801A-ND; ECCN_US/EU: EAR99/NEC; Manuf_Part_1: HMHA2801A; Distrib: DIGIKEY